# Altium schematic sheet 00 - REVISION.SchDoc
size 420 x 297 mm; Organization: ToyBuilder Labs; Address1: 2736 E Walnut St; Address2: Pasadena, California 91107; Address4: +1 (626) 808-4010; DocumentNumber: 1; SheetNumber: 1; SheetTotal: 4
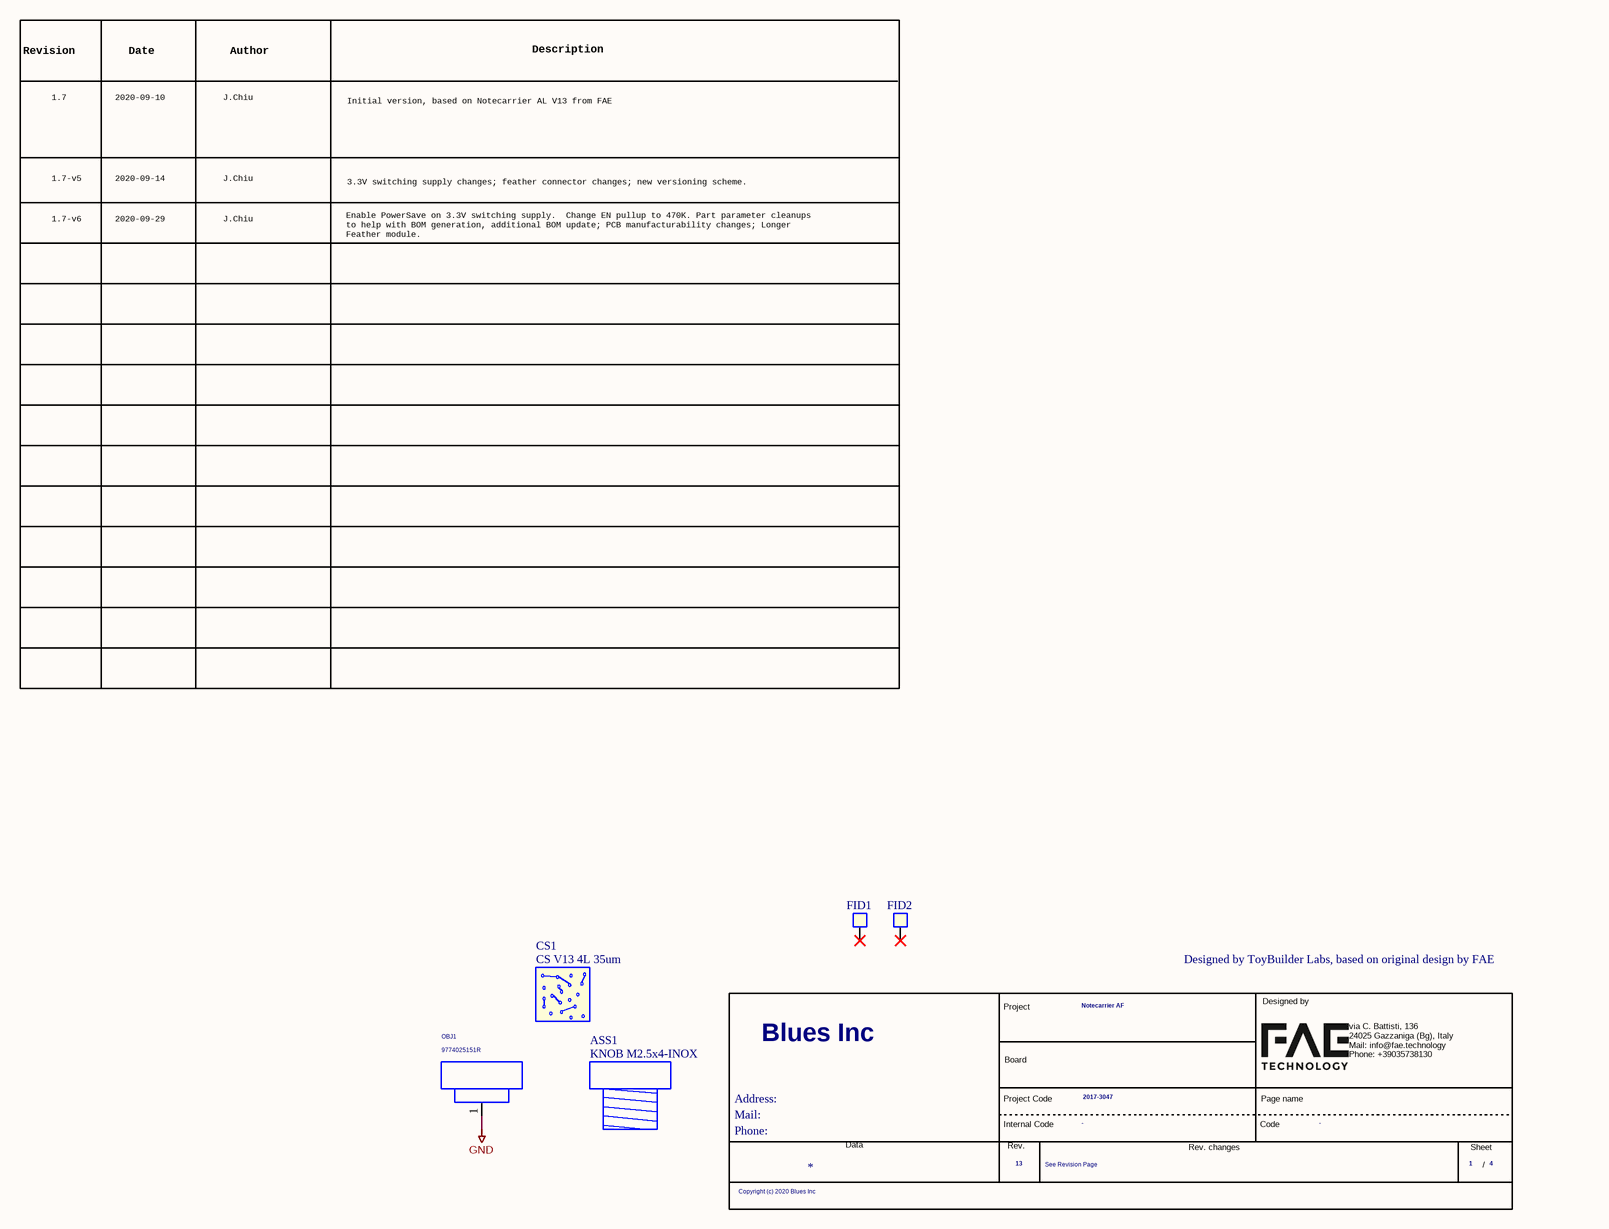
[diagram p0: 00 - REVISION.SchDoc]

## Parts
*  Address: Address:  Copyright: Copyright (c) 2020 Blues Inc  CustomerName: Blues Inc  DocumentoRev: See Revision Page  Mail: Mail:  Nome Progetto: Notecarrier AF  Page Count: 4  Page Number: 1  Phone: Phone:  Project Code: 2017-3047  Revision: 13  (hidden comment: MyBlues)  (graphical)
ASS1  KNOB M2.5x4-INOX  (mechanical)
CS1  CS V13 4L 35um  (mechanical)
FID1  TPS  [FIDUCIAL]  (value not drawn)
FID2  TPS  [FIDUCIAL]  (value not drawn)
OBJ1  9774025151R  [DIST-WASMSIM0250]

## Nets
GND: OBJ1.1

Not connected (* = marked no-connect by the designer): FID1 1(TP)*; FID2 1(TP)*

## Notes on the sheet
- Revision
- Date
- Author
- Description
- 1.7
- 2020-09-10
- J.Chiu
- Initial version, based on Notecarrier AL V13 from FAE
- 1.7-v5
- 1.7-v6
- 2020-09-14
- 2020-09-29
- 3.3V switching supply changes; feather connector changes; new versioning scheme.
- Enable PowerSave on 3.3V switching supply.  Change EN pullup to 470K. Part parameter cleanups to help with BOM generation, additional BOM update; PCB manufacturability changes; Longer Feather module.
- Designed by ToyBuilder Labs, based on original design by FAE
- Title
- Size:
- Date:
- B
- Number:
- Time:
- Revision:
- Sheet
- of
- File:
- (in symbol MyBlues) Designed by; Project; Board; via C. Battisti, 136 / 24025 Gazzaniga (Bg), Italy / Mail: info@fae.technology / Phone: +39035738130; Project Code; Page name; Internal Code; Code; Data; Rev.; Rev. changes; Sheet; /

## Library data of the parts
ASS1 = KNOB - M2.5x4-INOX: VITE TCEI 2.5X4 ESAGONO INCASSATO A2 INOX; Pkg Type: THT; Famiglia: MECCANICA; Caratteristiche: M2.5; Price Distributor Cad: 0,06; Modello: KNOB
CS1 = PCB-CS: C.S. NOTECARRIER-M2-AX V13 (75X65)mm 4L/SO/SR ENIG TG150 sp=1.6mm Cu=35um; Caratteristiche: Nome Schematico; Famiglia: CIRCUITO STAMPATO; Modello: Cliente; Note: Autore Schematico; Distributor: WE-ONLINE; Price Distributor Cad: 0
FID1 FID2 = FIDUCIAL: Pkg Type: SMD; Distributor: FAE; PCB Footprint: FIDUCIAL
OBJ1 = DISTANZIALE - M2.5x0250: DISTANZ. CIL. METALLO 5.1X2.5 9774025151R W.E SMT; Pkg Type: SMD; Famiglia: MECCANICA; Database: 44635; Caratteristiche: M2.5; Price Distributor Cad: 0,6225; Modello: DISTANZIALE; Distributor: FAE; PCB Footprint: DIST-WASMSIM0250; Supplier 1: Digi-Key; Supplier Part Number 1: 732-7078-1-ND
* = MyBlues: Customer Code: -; Database: -; Page Modify Date: *; FAE RD code: 2017-3047; Customer name: Blues Inc